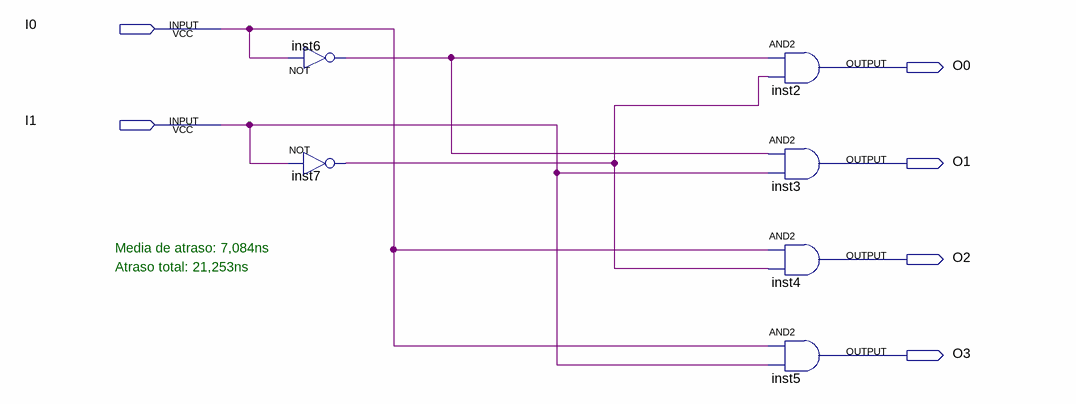
[diagram p0: schematic sheet]
// Quartus schematic decoder_2x4.bdf.bdf as structural Verilog: 6 symbols, 6 pins
module \decoder_2x4.bdf  (
  input  I0,
  input  I1,
  output O0,
  output O1,
  output O2,
  output O3
);

  wire inst6_out, inst7_out;

  not inst6 (inst6_out, I0);
  not inst7 (inst7_out, I1);
  and inst2 (O0, inst6_out, inst7_out);
  and inst3 (O1, inst6_out, I1);
  and inst4 (O2, I0, inst7_out);
  and inst5 (O3, I0, I1);

  // Notes on the sheet:
  //   Media de atraso: 7,084ns
  //   Atraso total: 21,253ns
endmodule
